# EAGLE schematic axiom_beta_shield_genio_v0.3_r1.2.ac7f6a19 (EAGLE 7.7.0)
Assembly variants: Beta, Min

## Sheet 1 of 2
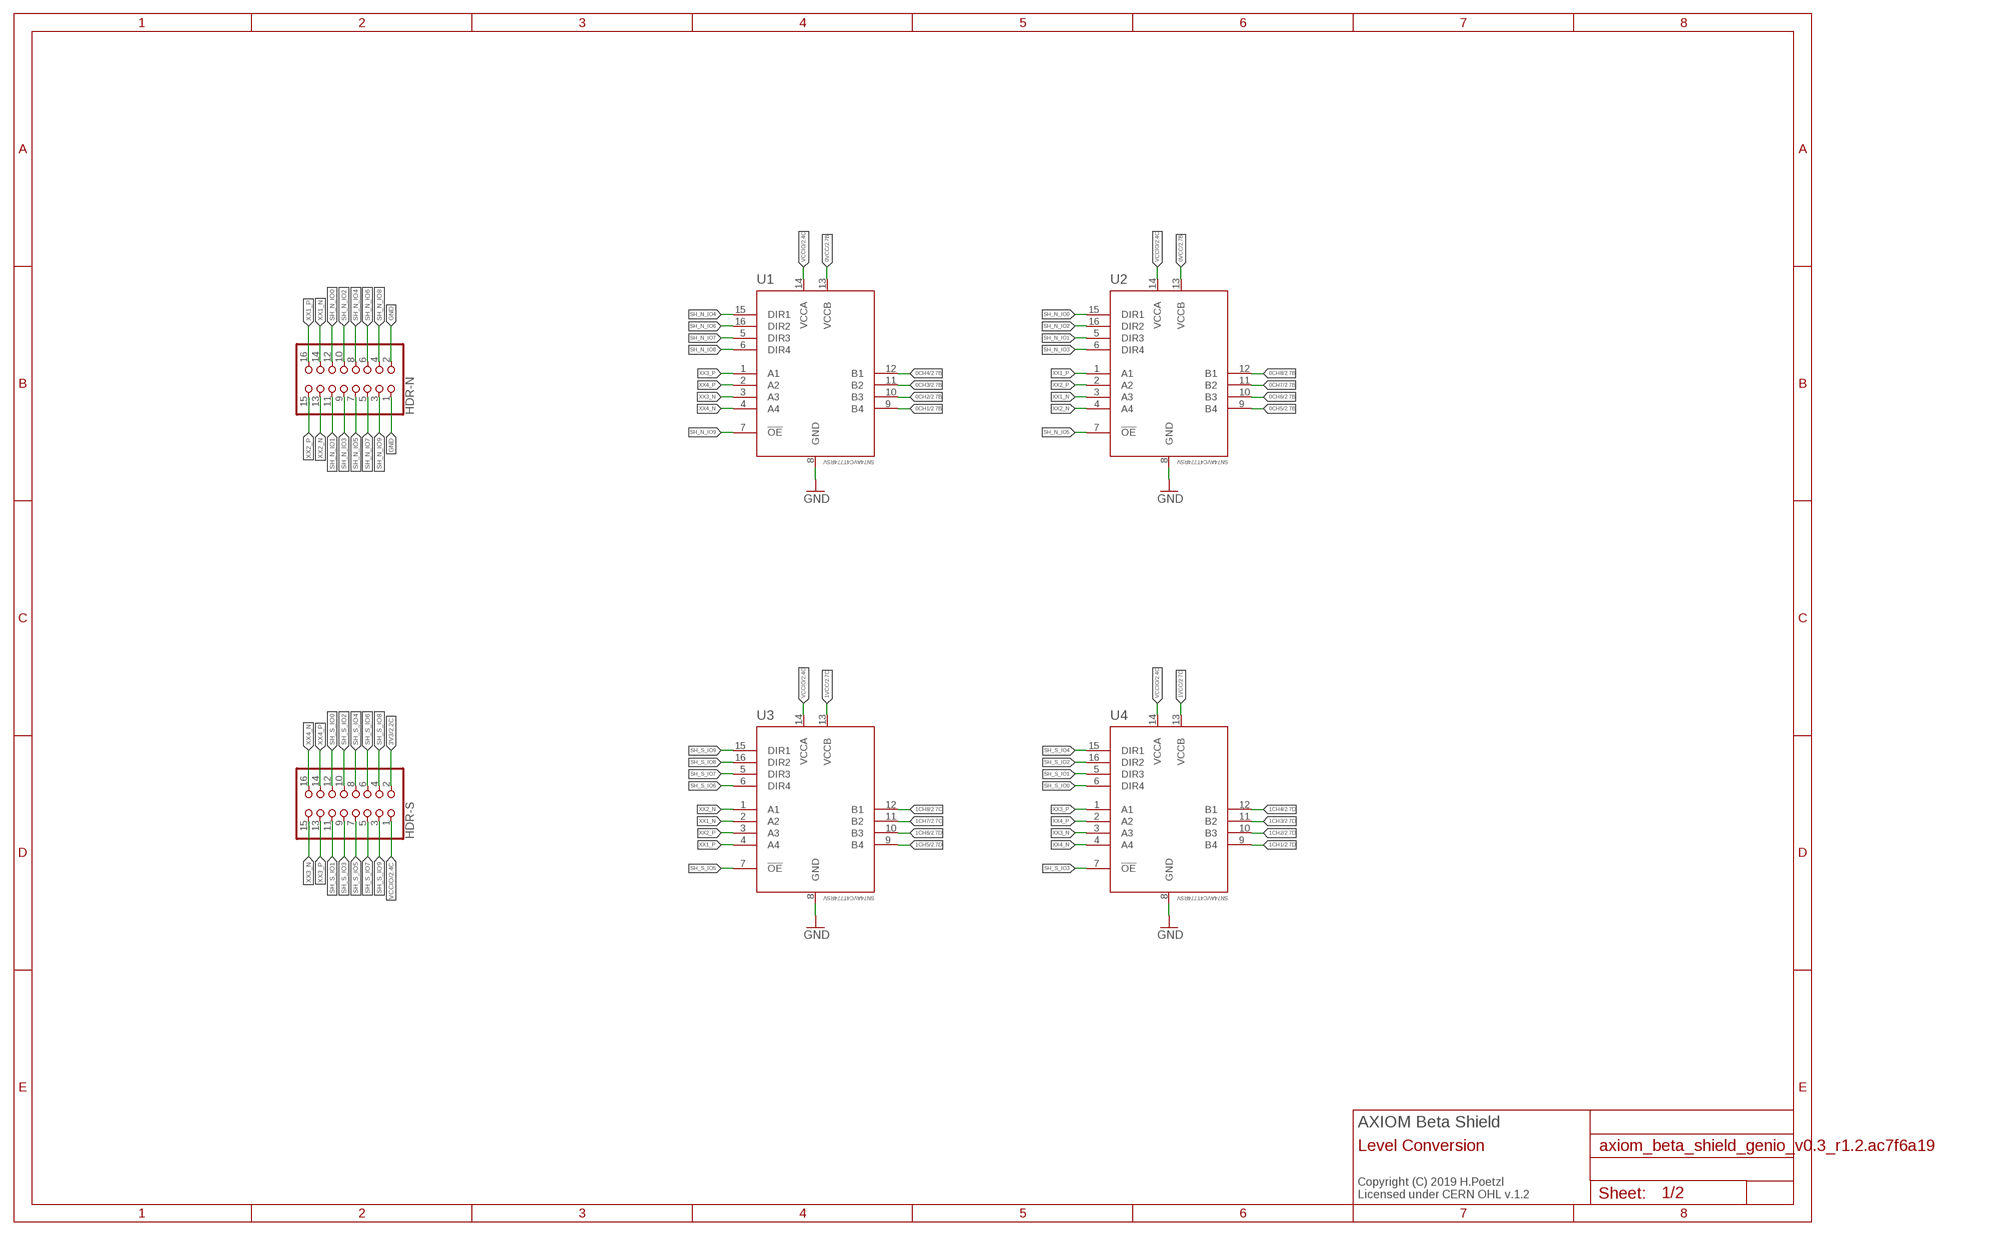
[diagram p0: schematic, sheet 1]

### Parts
HDR-N  PINHD-2X08_2.00_SMD  [2X08M_SMD]
HDR-S  PINHD-2X08_2.00_SMD  [2X08M_SMD]
U1  SN74AVC4T774RSV  [QFN40P185X265X55-16N]
U2  SN74AVC4T774RSV  [QFN40P185X265X55-16N]
U3  SN74AVC4T774RSV  [QFN40P185X265X55-16N]
U4  SN74AVC4T774RSV  [QFN40P185X265X55-16N]

### Nets
0CH1: U1.9(B4) ; also sheet 2
0CH2: U1.10(B3) ; also sheet 2
0CH3: U1.11(B2) ; also sheet 2
0CH4: U1.12(B1) ; also sheet 2
0CH5: U2.9(B4) ; also sheet 2
0CH6: U2.10(B3) ; also sheet 2
0CH7: U2.11(B2) ; also sheet 2
0CH8: U2.12(B1) ; also sheet 2
0VCC: U1.13(VCCB) U2.13(VCCB) ; also sheet 2
1CH1: U4.9(B4) ; also sheet 2
1CH2: U4.10(B3) ; also sheet 2
1CH3: U4.11(B2) ; also sheet 2
1CH4: U4.12(B1) ; also sheet 2
1CH5: U3.9(B4) ; also sheet 2
1CH6: U3.10(B3) ; also sheet 2
1CH7: U3.11(B2) ; also sheet 2
1CH8: U3.12(B1) ; also sheet 2
1VCC: U3.13(VCCB) U4.13(VCCB) ; also sheet 2
3V3: HDR-S.2 ; also sheet 2
GND: HDR-N.1 HDR-N.2 U1.8(GND) U2.8(GND) U3.8(GND) U4.8(GND) ; also sheet 2
SH_N_IO0: HDR-N.12 U2.15(DIR1)
SH_N_IO1: HDR-N.11 U2.5(DIR3)
SH_N_IO2: HDR-N.10 U2.16(DIR2)
SH_N_IO3: HDR-N.9 U2.6(DIR4)
SH_N_IO4: HDR-N.8 U1.15(DIR1)
SH_N_IO5: HDR-N.7 U2.7(!OE)
SH_N_IO6: HDR-N.6 U1.16(DIR2)
SH_N_IO7: HDR-N.5 U1.5(DIR3)
SH_N_IO8: HDR-N.4 U1.6(DIR4)
SH_N_IO9: HDR-N.3 U1.7(!OE)
SH_S_IO0: HDR-S.12 U4.6(DIR4)
SH_S_IO1: HDR-S.11 U4.5(DIR3)
SH_S_IO2: HDR-S.10 U4.16(DIR2)
SH_S_IO3: HDR-S.9 U4.7(!OE)
SH_S_IO4: HDR-S.8 U4.15(DIR1)
SH_S_IO5: HDR-S.7 U3.7(!OE)
SH_S_IO6: HDR-S.6 U3.6(DIR4)
SH_S_IO7: HDR-S.5 U3.5(DIR3)
SH_S_IO8: HDR-S.4 U3.16(DIR2)
SH_S_IO9: HDR-S.3 U3.15(DIR1)
VCCIO: HDR-S.1 U1.14(VCCA) U2.14(VCCA) U3.14(VCCA) U4.14(VCCA) ; also sheet 2
XX1_N: HDR-N.14 U2.3(A3) U3.2(A2)
XX1_P: HDR-N.16 U2.1(A1) U3.4(A4)
XX2_N: HDR-N.13 U2.4(A4) U3.1(A1)
XX2_P: HDR-N.15 U2.2(A2) U3.3(A3)
XX3_N: HDR-S.15 U1.3(A3) U4.3(A3)
XX3_P: HDR-S.13 U1.1(A1) U4.1(A1)
XX4_N: HDR-S.16 U1.4(A4) U4.4(A4)
XX4_P: HDR-S.14 U1.2(A2) U4.2(A2)

### Notes on the sheet
- AXIOM Beta Shield
- Level Conversion
- Copyright (C) 2019 H.Poetzl
  Licensed under CERN OHL v.1.2

## Sheet 2 of 2
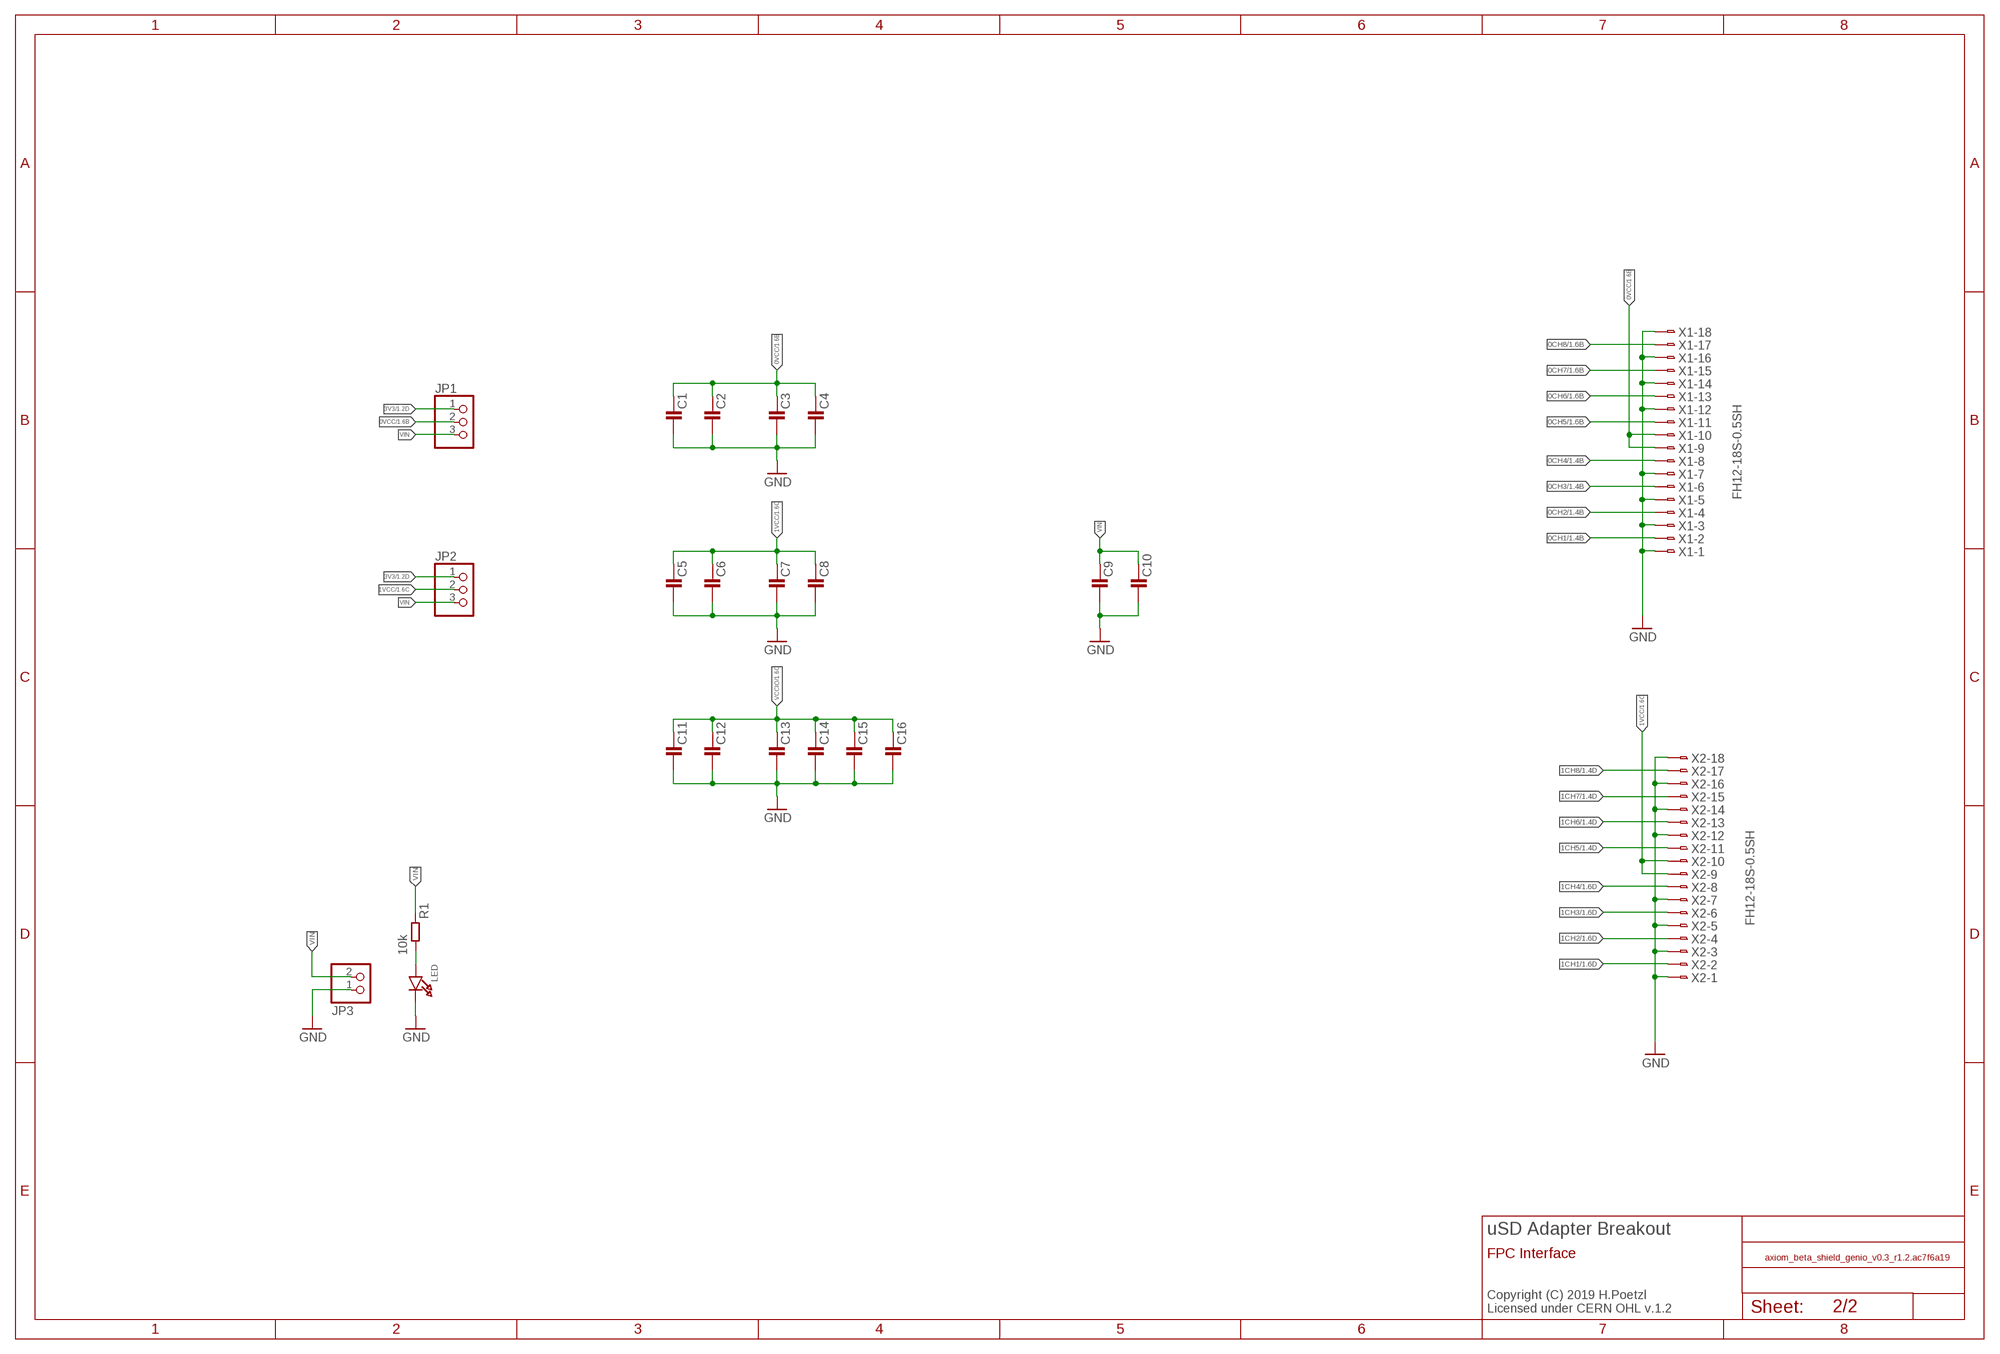
[diagram p1: schematic, sheet 2]

### Parts
C1  C0603-C  [0603-C]
C2  C0603-C  [0603-C]
C3  C0402-C  [0402-C]
C4  C0402-C  [0402-C]
C5  C0603-C  [0603-C]
C6  C0603-C  [0603-C]
C7  C0402-C  [0402-C]
C8  C0402-C  [0402-C]
C9  C0603-C  [0603-C]
C10  C0603-C  [0603-C]
C11  C0603-C  [0603-C]
C12  C0603-C  [0603-C]
C13  C0402-C  [0402-C]
C14  C0402-C  [0402-C]
C15  C0402-C  [0402-C]
C16  C0402-C  [0402-C]
JP1  PINHD-1X03_2.00-90°-S  [1X03M/90-S]
JP2  PINHD-1X03_2.00-90°-S  [1X03M/90-S]
JP3  PINHD-1X02_2.54-90°  [1X02/90]
LED  LED0603_NOOUTLINE  [CHIPLED_0603_NOOUTLINE]
R1  10k  R0402-B  [0402-B]
X1  FH12-18S-0.5SH  [FH12-18S-0.5SH]
X2  FH12-18S-0.5SH  [FH12-18S-0.5SH]

### Nets
0CH1: X1.2 ; also sheet 1
0CH2: X1.4 ; also sheet 1
0CH3: X1.6 ; also sheet 1
0CH4: X1.8 ; also sheet 1
0CH5: X1.11 ; also sheet 1
0CH6: X1.13 ; also sheet 1
0CH7: X1.15 ; also sheet 1
0CH8: X1.17 ; also sheet 1
0VCC: C1.1 C2.1 C3.1 C4.1 JP1.2 X1.9 X1.10 ; also sheet 1
1CH1: X2.2 ; also sheet 1
1CH2: X2.4 ; also sheet 1
1CH3: X2.6 ; also sheet 1
1CH4: X2.8 ; also sheet 1
1CH5: X2.11 ; also sheet 1
1CH6: X2.13 ; also sheet 1
1CH7: X2.15 ; also sheet 1
1CH8: X2.17 ; also sheet 1
1VCC: C5.1 C6.1 C7.1 C8.1 JP2.2 X2.9 X2.10 ; also sheet 1
3V3: JP1.1 JP2.1 ; also sheet 1
GND: C1.2 C2.2 C3.2 C4.2 C5.2 C6.2 C7.2 C8.2 C9.2 C10.2 C11.2 C12.2 C13.2 C14.2 C15.2 C16.2 JP3.1 LED.C X1.1 X1.3 X1.5 X1.7 X1.12 X1.14 X1.16 X1.18 X2.1 X2.3 X2.5 X2.7 X2.12 X2.14 X2.16 X2.18 ; also sheet 1
N$1: LED.A R1.2
VCCIO: C11.1 C12.1 C13.1 C14.1 C15.1 C16.1 ; also sheet 1
VIN: C9.1 C10.1 JP1.3 JP2.3 JP3.2 R1.1

### Notes on the sheet
- uSD Adapter Breakout
- FPC Interface
- Copyright (C) 2019 H.Poetzl
  Licensed under CERN OHL v.1.2

## Library data of the parts
C1-C16 = generic-rcl:C
HDR-N HDR-S = pincon:PINHD-2X08: PIN HEADER
JP1 JP2 = pinhead-2:PINHD-1X03: PIN HEADER
JP3 = pinhead-2:PINHD-1X02: PIN HEADER
LED = microbuilder:LED: LED 0603 - 0603 Surface Mount Package 2mA: Green LED - Low Power (3.9mcd, 2ma, 1.7Vf) - Digikey: 475-2709-2-ND Orange LED - Low Power (9.8mcd, 2ma, 1.8Vf) - Digikey: 475-1194-2-ND Red LED - Low Power (5mcd, 2ma, 1.8Vf) - Digikey: 475-1195-2-ND Yellow LED - Low Power (7mcd, 2ma, 1.8Vf) - Digikey: 475-1196-2-ND 5mA: Blue LED - Low Power (17mcd, 5ma, 2.9Vf) - Digikey: LNJ937W8CRACT-ND 0805 - 0805 Surface Mount Package 2mA: Red LED (8.8mcd, 2mA, 1.8Vf, Clear) - Low Power [Digikey: 475-2510-1-ND] Green LED (5mcd, 2mA, 1.8Vf, Clear) - Low Power [Digikey: 475-2730-1-ND] Yellow LED (11.3mcd, 2mA, 1.8Vf, Clear) - Low Power [Digikey: 475-2555-1-ND] 20mA: Red LED (104mcd, 20mA, Diffused) - LS R976 [Digikey: 475-1278-6-ND] Red LED (12mcd, 20mA, 2.0Vf, Clear) - APT2012EC [Digikey: 754-1128-1-ND] Green LED (15mcd, 20mA, 2.2Vf, Clear) - APT2012GC [Digikey: 754-1131-1-ND] Orange LED (160mcd, 20mA, 2.1Vf, Clear) - APT2012SECK [Digikey: 754-1130-1-ND] 1206 - 1206 Surface Mount Package Green LED (26mcd, 20mA, Diffused) - LG N971 [Digikey: 475-1407-6-ND] Red LED (15mcd, 20mA, Diffused) - LH N974 [Digikey: 475-1416-6-ND]
R1 = generic-rcl:R
U1-U4 = lvltrans:SN74AVC4T774: 4-BIT DUAL-SUPPLY BUS TRANSCEIVER
X1 X2 = con-hirose:FH12-18S-0.5S: 0.5mm Pitch Connectors For FPC/FFC Source: Data sheet <http://www.hirose.co.jp/cataloge_hp/e58605370.pdf>; MPN: FH12-18S-0.5SH(55); OC_FARNELL: 1324547; OC_NEWARK: 34M6164

## Net classes
0 default: width 0.152 mm, drill 0.254 mm
1 power: width 0.152 mm, drill 0.254 mm